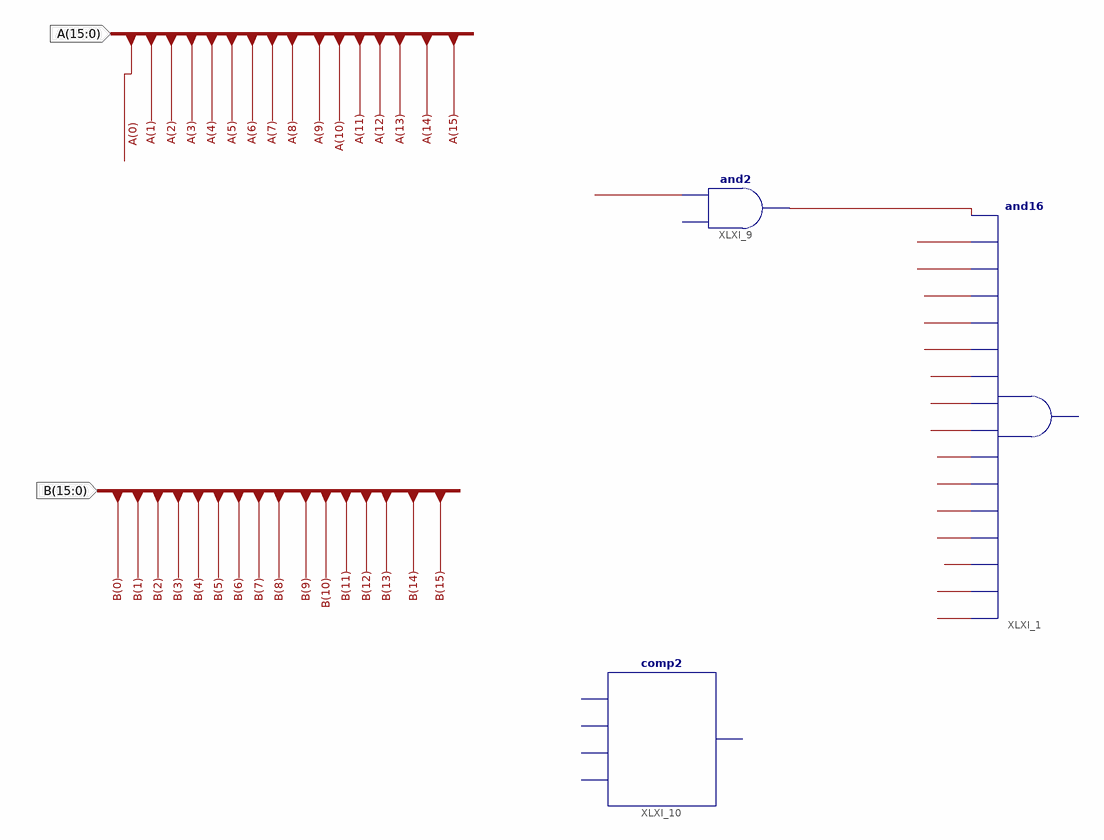
[diagram p0: schematic sheet 1]
// Xilinx ISE schematic adder16x1.sch (spartan3e) as structural Verilog: 3 symbols, 2 ports
module adder16x1 (
  input  [15:0] B,
  input  [15:0] A
);

  wire XLXN_59, XLXN_60, XLXN_61, XLXN_62, XLXN_63, XLXN_64, XLXN_65, XLXN_66, XLXN_67, XLXN_68, XLXN_69,
       XLXN_70, XLXN_71, XLXN_72, XLXN_73, XLXN_189;
  wire [0:0] input0;

  // and16 XLXI_1 has open pins: I0=XLXN_73, I1=XLXN_72, I2=XLXN_71, I3=XLXN_70, I4=XLXN_69, I5=XLXN_68, I6=XLXN_67, I7=XLXN_66, I8=XLXN_65, I9=XLXN_64, I10=XLXN_63, I11=XLXN_62, I12=XLXN_61, I13=XLXN_60, I14=XLXN_59, I15=XLXN_189, O=open
  buf XLXI_9 (XLXN_189, input0[0]);  // and2 open: I0
  comp2 XLXI_10 ();  // open: A0, A1, B0, B1, EQ
endmodule
